# Altium schematic sheet actuator.SchDoc: Actuator Controls
size Letter
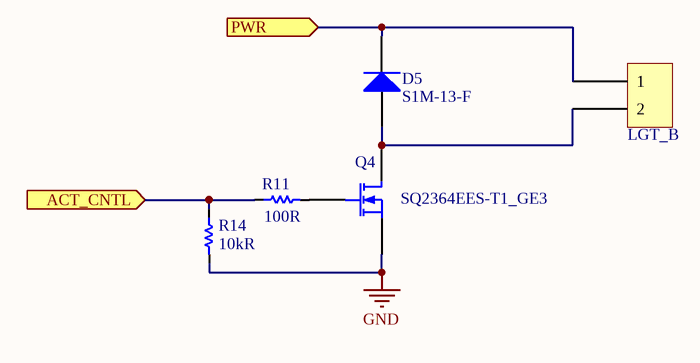
[diagram p0: actuator.SchDoc]

## Parts
D5  S1M-13-F  [SMA]
LGT_B  MOLEX_43650_2  [MOLEX_43650_2]  (value not drawn)
Q4  Manufacturer Part Number: SQ2364EES-T1_GE3  [SOT23-3]  (hidden comment: MOSFET-N)
R11  Resistance: 100R  [RES 0603 L]  (hidden comment: value)
R14  Resistance: 10kR  [RES 0603 L]  (hidden comment: value)

## Ports
ACT_CNTL (in), PWR (in)

## Nets
GND: Q4.3(S) R14.1
ACT_CNTL: R11.2 R14.2 ; port ACT_CNTL
PWR: D5.2(K) LGT_B.1 ; port PWR
NetD5_1: D5.1(A) LGT_B.2 Q4.1(D)
NetQ4_2: Q4.2(G) R11.1

## Notes on the sheet
- Title
- Size:
- Date:
- Letter
- Number:
- Time:
- Revision:
- Sheet
- of
- File:

## Library data of the parts
D5 = Diode: Default Diode
LGT_B = MOLEX_43650_2: MOLEX - 43650-0227 - Wire-To-Board Connector, 3 mm, 2 Contacts, Header, Micro-Fit 3.0 43650 Series, Through Hole, 1 Rows; Connector Type: Header,Male Pin; Number of Positions: 2; Number of Ports: 1; Pitch: 3mm; Supplier 1: Digi-Key; Supplier Part Number 1: WM10656-ND; Manufacturer: Molex; Manufacturer Part Number: 43650-0227; Category: Connectors; Pricing 1: 1=0.80000, 10=0.74800, 100=0.57340, 500=0.49860, 1000=0.41135, 5000=0.36149, 10000=0.33656 (USD); Mount: Through Hole; Contact Plating: Tin,Bright; Color: Black; Contact Material: Brass; Housing Material: Thermoplastic; Number of Terminals: 2; Contact Shape: Square; Insulation Material: Polymer; Min Operating Temperature: -40°C; Max Operating Temperature: 105°C; Packaging: Tray; Package Quantity: 3264; Number of Rows: 1; Termination: Solder; Fastening Type: Ramp; Number of Contacts: 2; Orientation: Straight; Length: 9.65mm; Depth: 5.57mm; ComponentLink1URL: https://datasheet.ciiva.com/6840/436500227-sd-6840390.pdf?src-supplier=Digi-Key; ComponentLink1Description: https://datasheet.ciiva.com/6840/436500227-sd-6840390.pdf?src-supplier=Digi-Key; ComponentLink2URL: https://datasheet.ciiva.com/3944/28290436500227-pcb-headers-3944690.pdf?src-supplier=Arrow; ComponentLink2Description: https://datasheet.ciiva.com/3944/28290436500227-pcb-headers-3944690.pdf?src-supplier=Arrow; ComponentLink3URL: https://datasheet.ciiva.com/30077/0436500227-pcb-headers-30077244.pdf?src-supplier=Onlinecomponents.com; ComponentLink3Description: https://datasheet.ciiva.com/30077/0436500227-pcb-headers-30077244.pdf?src-supplier=Onlinecomponents.com; ComponentLink4URL: https://datasheet.ciiva.com/7920/1629867-7920765.pdf?src-supplier=Element14; ComponentLink4Description: https://datasheet.ciiva.com/7920/1629867-7920765.pdf?src-supplier=Element14
Q4 = MOSFET-N: Trans MOSFET N-CH 60V 2A Automotive 3-Pin SOT-23 T/R; Manufacturer: Vishay; Supplier 1: Digi-Key; Supplier Part Number 1: SQ2364EES-T1_GE3CT-ND; Pricing 1: 1=0.58000, 10=0.49500, 25=0.46200, 100=0.34320, 250=0.32604, 500=0.26796, 1000=0.21780 (USD); ComponentLink1URL: http://www.farnell.com/datasheets/2611857.pdf?src-supplier=Farnell; ComponentLink1Description: http://www.farnell.com/datasheets/2611857.pdf?src-supplier=Farnell; ComponentLink2URL: http://www.farnell.com/datasheets/2611857.pdf?src-supplier=Newark; ComponentLink2Description: http://www.farnell.com/datasheets/2611857.pdf?src-supplier=Newark
R11 = RES 0603: CRGCQ 0603 100R 5%; Manufacturer: TE Connectivity; Manufacturer Part Number: CRGCQ0603J100R; Max Power Dissipation: 100mW; Temperature Coefficient: 100ppm/°C; Supplier 1: Digi-Key; Supplier Part Number 1: A130085CT-ND; Category: Chip SMD Resistors; Pricing 1: 1=0.10000, 10=0.02100, 100=0.00860, 1000=0.00387, 2500=0.00336 (USD); Case/Package: 0603; Case Code (Imperial): 0603; Case Code (Metric): 1608; Min Operating Temperature: -55°C; Max Operating Temperature: 155°C; Composition: Thick Film; Features: Moisture Resistant,Automotive AEC-Q200; Packaging: Cut Tape; Tolerance: 5%; Number of Terminations: 2; ComponentLink1URL: https://www.te.com/commerce/DocumentDelivery/DDEController?Action=srchrtrv&amp;DocNm=1773204-3&amp;DocType=DS&amp;DocLang=English&src-supplier=Digi-Key; ComponentLink1Description: https://www.te.com/commerce/DocumentDelivery/DDEController?Action=srchrtrv&amp;DocNm=1773204-3&amp;DocType=DS&amp;DocLang=English&src-supplier=Digi-Key
R14 = RES 0603: TE CONNECTIVITY - CRGCQ0603J10K - RES, 10K, 5%, 0603, THICK FILM; Max Power Dissipation: 100mW; Temperature Coefficient: 100ppm/°C; Supplier 1: Digi-Key; Supplier Part Number 1: A130097CT-ND; Manufacturer: TE Connectivity; Manufacturer Part Number: CRGCQ0603J10K; Category: Chip SMD Resistors; Pricing 1: 1=0.10000, 10=0.02100, 100=0.00860, 1000=0.00387, 2500=0.00336 (USD); Case/Package: 0603; Case Code (Imperial): 0603; Case Code (Metric): 1608; Min Operating Temperature: -55°C; Max Operating Temperature: 155°C; Composition: Thick Film; Features: Moisture Resistant,Automotive AEC-Q200; Packaging: Tape and Reel; Tolerance: 5%; Number of Terminations: 2; ComponentLink1URL: https://4donline.ihs.com/images/VipMasterIC/IC/TYEL/TYEL-S-A0004929575/TYEL-S-A0004929575-1.pdf?hkey=52A5661711E402568146F3353EA87419&src-supplier=Farnell; ComponentLink1Description: https://4donline.ihs.com/images/VipMasterIC/IC/TYEL/TYEL-S-A0004929575/TYEL-S-A0004929575-1.pdf?hkey=52A5661711E402568146F3353EA87419&src-supplier=Farnell; ComponentLink2URL: https://4donline.ihs.com/images/VipMasterIC/IC/TYEL/TYEL-S-A0004929575/TYEL-S-A0004929575-1.pdf?hkey=52A5661711E402568146F3353EA87419&src-supplier=Newark; ComponentLink2Description: https://4donline.ihs.com/images/VipMasterIC/IC/TYEL/TYEL-S-A0004929575/TYEL-S-A0004929575-1.pdf?hkey=52A5661711E402568146F3353EA87419&src-supplier=Newark; ComponentLink3URL: https://www.te.com/commerce/DocumentDelivery/DDEController?Action=srchrtrv&amp;DocNm=1773204-3&amp;DocType=DS&amp;DocLang=English&src-supplier=Digi-Key; ComponentLink3Description: https://www.te.com/commerce/DocumentDelivery/DDEController?Action=srchrtrv&amp;DocNm=1773204-3&amp;DocType=DS&amp;DocLang=English&src-supplier=Digi-Key; ComponentLink4URL: http://www.te.com/commerce/DocumentDelivery/DDEController?Action=srchrtrv&DocNm=1773204-3&DocType=DS&DocLang=English&src-supplier=Digi-Key; ComponentLink4Description: http://www.te.com/commerce/DocumentDelivery/DDEController?Action=srchrtrv&DocNm=1773204-3&DocType=DS&DocLang=English&src-supplier=Digi-Key